# EAGLE design monitor_riser (EAGLE 9.3.0)
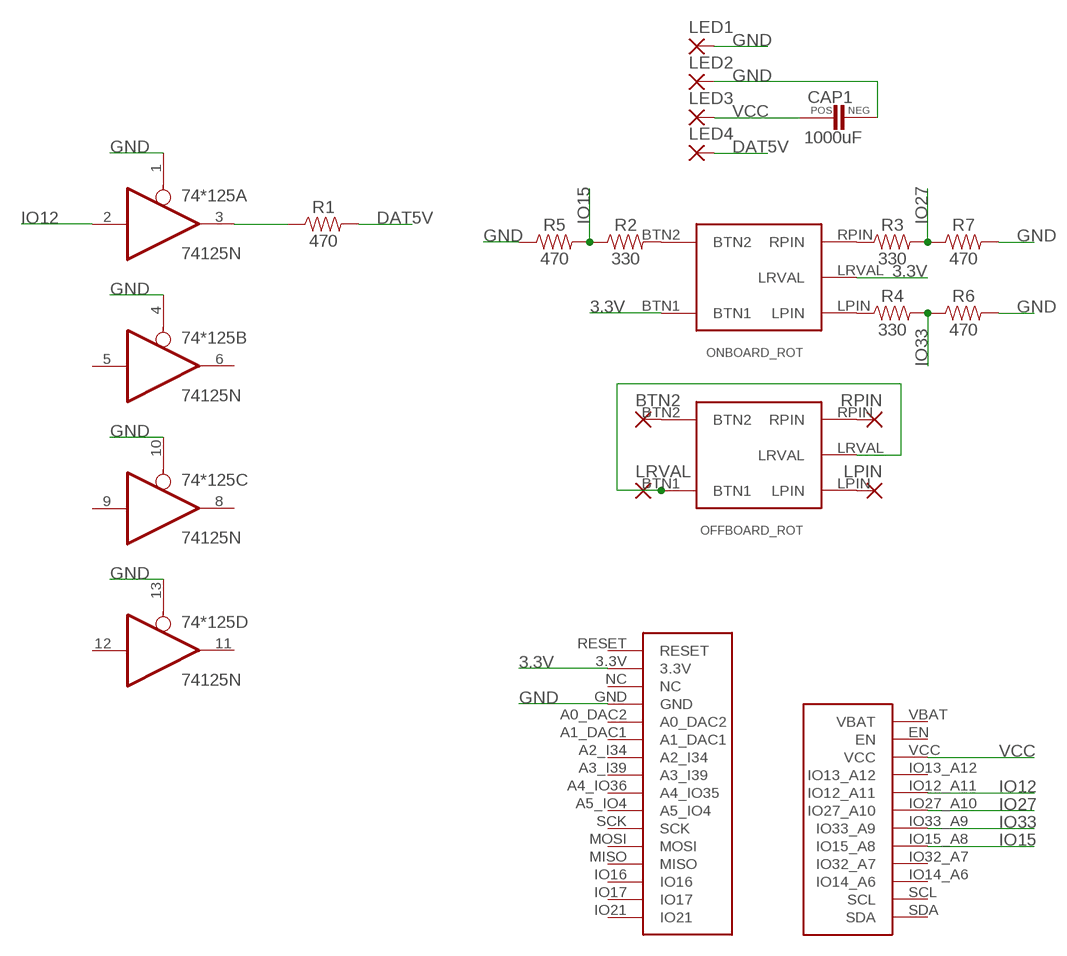
[diagram p0: schematic, sheet 1]

## Parts
74*125  74125N  [DIL14]
BTN2  1,6/0,9  [1,6/0,9]
CAP1  1000uF  CAP1000UF_0807_0304  [CAP1000UF_0807_0304]
LED1  1,6/0,9  [1,6/0,9]
LED2  1,6/0,9  [1,6/0,9]
LED3  1,6/0,9  [1,6/0,9]
LED4  1,6/0,9  [1,6/0,9]
LPIN  1,6/0,9  [1,6/0,9]
LRVAL  1,6/0,9  [1,6/0,9]
OFFBOARD_ROT  ROTARYENCODER  [ROTARYENCODER]
ONBOARD_ROT  ROTARYENCODER  [ROTARYENCODER]
R1  470  RESISTORAXIAL-0.3  [AXIAL-0.3]
R2  330  RESISTORAXIAL-0.3  [AXIAL-0.3]
R3  330  RESISTORAXIAL-0.3  [AXIAL-0.3]
R4  330  RESISTORAXIAL-0.3  [AXIAL-0.3]
R5  470  RESISTORAXIAL-0.3  [AXIAL-0.3]
R6  470  RESISTORAXIAL-0.3  [AXIAL-0.3]
R7  470  RESISTORAXIAL-0.3  [AXIAL-0.3]
RPIN  1,6/0,9  [1,6/0,9]
U$1  FEATHER32  [FEATHER32]

## Nets
3.3V: ONBOARD_ROT.BTN1 ONBOARD_ROT.LRVAL U$1.3.3V
DAT5V: LED4.1(P) R1.P$2
GND: 74*125.1(A:OE) 74*125.4(B:OE) 74*125.10(C:OE) 74*125.13(D:OE) CAP1.NEG LED1.1(P) LED2.1(P) R5.P$1 R6.P$2 R7.P$2 U$1.GND
IO12: 74*125.2(A:I) U$1.IO12_A11
IO15: R2.P$1 R5.P$2 U$1.IO15_A8
IO27: R3.P$2 R7.P$1 U$1.IO27_A10
IO33: R4.P$2 R6.P$1 U$1.IO33_A9
N$1: 74*125.3(A:O) R1.P$1
N$2: ONBOARD_ROT.BTN2 R2.P$2
N$3: ONBOARD_ROT.RPIN R3.P$1
N$4: ONBOARD_ROT.LPIN R4.P$1
N$5: LRVAL.1(P) OFFBOARD_ROT.BTN1 OFFBOARD_ROT.LRVAL
N$6: BTN2.1(P) OFFBOARD_ROT.BTN2
N$8: LPIN.1(P) OFFBOARD_ROT.LPIN
N$9: OFFBOARD_ROT.RPIN RPIN.1(P)
VCC: CAP1.POS LED3.1(P) U$1.VCC
Unconnected: 74*125.5(B:I) 74*125.6(B:O) 74*125.8(C:O) 74*125.9(C:I) 74*125.11(D:O) 74*125.12(D:I) U$1.A0_DAC2 U$1.A1_DAC1 U$1.A2_I34 U$1.A3_I39 U$1.A4_IO36(A4_IO35) U$1.A5_IO4 U$1.EN U$1.IO13_A12 U$1.IO14_A6 U$1.IO16 U$1.IO17 U$1.IO21 U$1.IO32_A7 U$1.MISO U$1.MOSI U$1.NC U$1.RESET U$1.SCK U$1.SCL U$1.SDA U$1.VBAT

## Power pins joined to a net without a drawn wire
GND: 74*125.7(P:GND)
VCC: 74*125.14(P:VCC)

## Library data of the parts
74*125 = 74xx-us:74*125: Quad bus BUFFER, 3-state
BTN2 LED1-LED4 LPIN LRVAL RPIN = wirepad:1,6/0,9: THROUGH-HOLE PAD
CAP1 = personal:CAP1000UF_0807_0304: Probably a 1000uF through-hole 16v capacitor. Pins are 2.94mm appart and 0.57mm thick. Head is 8mm wide and 7mm tall.
OFFBOARD_ROT ONBOARD_ROT = personal:ROTARYENCODER: Rotary encoder. Pins are on a 0.1in grid, and are 0.6in apart. The case is 0.5in x 0.52in wide, and 0.9in tall. L/R Pins A twist to the right will start with the L pin, then both pins, then the R pin, then neither. A twist to the left will follow the opposite order (R, both, L, neither). BTN Pins When the button is pressed, it will short circuit BTN1 with BTN2.
R1-R7 = SparkFun-Resistors:RESISTOR: Generic Resistor Package
U$1 = personal:FEATHER32

## Board
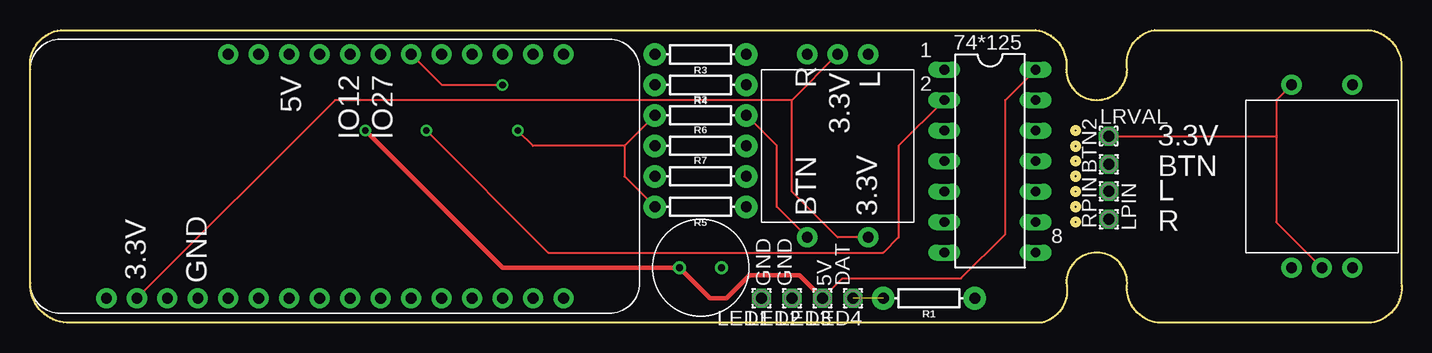
[diagram p1: board, top side]
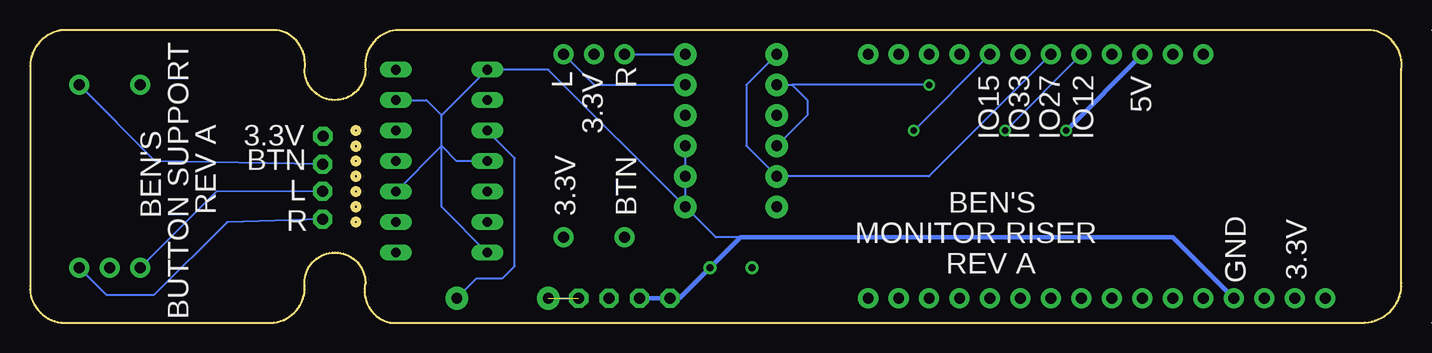
[diagram p2: board, bottom side, seen from below]

Size 114.35 x 24.38 mm. Coordinates in mm from the lower left corner, seen from the top.
Outline: 0.02,3.3 0.02,21.08 arc-90 2.56,24.38 83.84,24.38 arc-90 86.38,21.08 arc90 88.92,18.54 arc90 91.46,21.08 arc-90 93.75,24.38 111.53,24.38 arc-90 114.32,21.08 114.32,3.3 arc-90 111.78,0 94,0 arc-90 91.46,3.3 arc90 88.92,5.84 arc90 86.38,3.3 arc-90 84.35,0 3.07,0 arc-90 0.02,3.3
Copper layers (1*16): Top 0.035mm / dielectric 1.5mm / Bottom 0.035mm
Design rules "default": minimum track width 6mil, minimum drill 0.35mm, track to track 6mil, track to pad 6mil, pad to pad 6mil, via to via 6mil, smd to smd 6mil, copper to edge 40mil, drill to drill 6mil, minimum pad ring 10mil, minimum via ring 8mil, stop-mask expansion 4mil, vias tented up to drill 0mil, thermal gap 10mil
Milling: area 86.9,8.1 to 87.4,8.6; area 86.9,9.4 to 87.4,9.9; area 86.9,10.7 to 87.4,11.2; area 86.9,13.2 to 87.4,13.7; area 86.9,15.7 to 87.4,16.3; area 86.9,14.4 to 87.4,15; area 86.9,11.9 to 87.4,12.5

### Footprints (pad centres in the part's own frame; a part is rotated, then mirrored left to right if it is on the bottom)
DIL14 = drill 0.813 long: 1 -7.62,-3.81; 2 -5.08,-3.81; 3 -2.54,-3.81; 4 0,-3.81; 5 2.54,-3.81; 6 5.08,-3.81; 7 7.62,-3.81; 8 7.62,3.81; 9 5.08,3.81; 10 2.54,3.81; 11 0,3.81; 12 -2.54,3.81; 13 -5.08,3.81; 14 -7.62,3.81
1,6/0,9 = drill 0.914 pad 1.6 octagon: 1 0,0
CAP1000UF_0807_0304 = drill 0.6: NEG 1.75,0; POS -1.75,0
ROTARYENCODER = drill 0.9 pad 1.676: BTN1 -2.54,7.62; BTN2 2.54,7.62; LPIN -2.54,-7.62; LRVAL 0,-7.62; RPIN 2.54,-7.62
AXIAL-0.3 = drill 0.9 pad 1.88: P$1 -3.81,0; P$2 3.81,0
FEATHER32 = drill 0.9 pad 1.676: 3.3V -10.16,16.51; A0_DAC2 -10.16,8.89; A1_DAC1 -10.16,6.35; A2_I34 -10.16,3.81; A3_I39 -10.16,1.27; A4_IO36 -10.16,-1.27; A5_IO4 -10.16,-3.81; EN 10.16,6.35; GND -10.16,11.43; IO12_A11 10.16,-1.27; IO13_A12 10.16,1.27; IO14_A6 10.16,-13.97; IO15_A8 10.16,-8.89; IO16 -10.16,-13.97; IO17 -10.16,-16.51; IO21 -10.16,-19.05; IO27_A10 10.16,-3.81; IO32_A7 10.16,-11.43; IO33_A9 10.16,-6.35; MISO -10.16,-11.43; MOSI -10.16,-8.89; NC -10.16,13.97; RESET -10.16,19.05; SCK -10.16,-6.35; SCL 10.16,-16.51; SDA 10.16,-19.05; VBAT 10.16,8.89; VCC 10.16,3.81

### Placement (x,y rotation side)
74*125  80.03,13.46 270 top
BTN2  89.94,13.19 90 top
CAP1  55.9,4.57 0 top
LED1  60.98,2.03 180 top
LED2  63.52,2.03 180 top
LED3  66.06,2.03 180 top
LED4  68.6,2.03 180 top
LPIN  89.94,10.94 270 top
LRVAL  89.92,15.54 0 top
OFFBOARD_ROT  107.7,12.19 0 top
ONBOARD_ROT  67.33,14.73 180 top
R1  74.95,2.03 180 top
R2  55.9,17.27 0 top
R3  55.9,22.35 180 top
R4  55.9,19.81 180 top
R5  55.9,9.65 180 top
R6  55.9,14.73 0 top
R7  55.9,12.19 0 top
RPIN  89.94,8.62 90 top
U$1  25.42,12.19 90 top

### Tracks (layer width: path | path; a pad name or v marks a point on that pad's centre or on a via)
3.3V
  Top 0.152: U$1.3.3V 25.42,18.54 63.52,18.54 | 63.52,18.54 ONBOARD_ROT.LRVAL | ONBOARD_ROT.BTN1 67.33,7.11 63.52,10.92 63.52,18.54
DAT5V  (1 unrouted)
  Bottom 0.152: R1.P$2 LED4.1
GND
  Bottom 0.152: 74*125.10 80.03,14.73 | 80.03,17.27 74*125.1 71.14,21.08 R5.P$1 | 80.03,14.73 80.03,17.27 | 74*125.13 81.3,18.54 80.03,17.27 | 74*125.4 78.76,13.46 80.03,14.73 | 74*125.7 80.03,9.65 80.03,14.73 | 54.63,7.11 57.17,7.11 R5.P$1 | R5.P$1 R7.P$2 R6.P$2
  Bottom 0.381: U$1.GND 19.07,7.11 54.63,7.11 55.11,7.11 CAP1.NEG 60.19,2.03 LED1.1 LED2.1
IO12  (via drill 0.55)
  Top 0.152: 74*125.2 72.41,14.73 72.41,7.11 71.14,5.84 43.2,5.84 v33.04,16
  Bottom 0.152: U$1.IO12_A11 v33.04,16
IO15  (via drill 0.55)
  Top 0.152: R2.P$1 49.55,14.73 | R5.P$2 49.55,12.19 49.55,14.73 | 49.55,14.73 41.93,14.73 v40.66,16
  Bottom 0.152: v40.66,16 U$1.IO15_A8
IO27
  Bottom 0.152: R3.P$2 54.63,19.81 54.63,14.73 R7.P$1 39.39,12.19 U$1.IO27_A10
IO33  (via drill 0.55)
  Top 0.152: U$1.IO33_A9 34.31,19.81 v39.39,19.81
  Bottom 0.152: R4.P$2 50.82,19.81 | 50.82,19.81 49.55,18.54 49.55,17.27 R6.P$1 | v39.39,19.81 50.82,19.81
N$1
  Bottom 0.152: R1.P$1 77.11,3.68 74.95,3.68 73.94,4.7 73.94,13.72 74*125.3
N$2
  Top 0.152: ONBOARD_ROT.BTN2 62.25,9.65 62.25,14.73 R2.P$2
N$3
  Bottom 0.152: ONBOARD_ROT.RPIN R3.P$1
N$4
  Bottom 0.152: ONBOARD_ROT.LPIN 67.33,19.81 R4.P$1
N$5
  Top 0.152: LRVAL.1 103.89,15.54 | OFFBOARD_ROT.BTN1 103.89,18.54 103.89,15.54 | 103.89,15.54 103.89,8.38 OFFBOARD_ROT.LRVAL
N$6
  Bottom 0.152: BTN2.1 103.89,13.46 OFFBOARD_ROT.BTN2
N$8
  Bottom 0.152: LPIN.1 98.81,10.92 OFFBOARD_ROT.LPIN
N$9
  Bottom 0.152: RPIN.1 97.92,8.38 104.02,2.29 107.96,2.29 OFFBOARD_ROT.RPIN
VCC  (via drill 0.55)
  Top 0.152: LED3.1 67.71,3.68 77.62,3.68 81.3,7.37 81.3,18.54 74*125.14
  Top 0.381: LED3.1 64.16,3.94 59.97,3.94 58.06,2.03 56.69,2.03 CAP1.POS 39.39,4.57 v27.96,16
  Bottom 0.381: U$1.VCC v27.96,16

### Text on the board
tPlace: 1 | R | L | 2 | 5V | 3.3V | IO12 | IO27 | 3.3V | BTN | L | BTN | 3.3V | R | 8 | 3.3V | GND | GND | GND | 5V | DAT
bPlace: BUTTON SUPPORT | R | L | 5V | REV A | 3.3V | BEN'S | IO12 | IO27 | IO33 | IO15 | 3.3V | BTN | BEN'S | L | BTN | 3.3V | MONITOR RISER | R | REV A | 3.3V | GND